# EAGLE design AST1031 (EAGLE 6.3)
DATABASE: ./../../../../../Components/TinyCircuits_Part_Database.txt
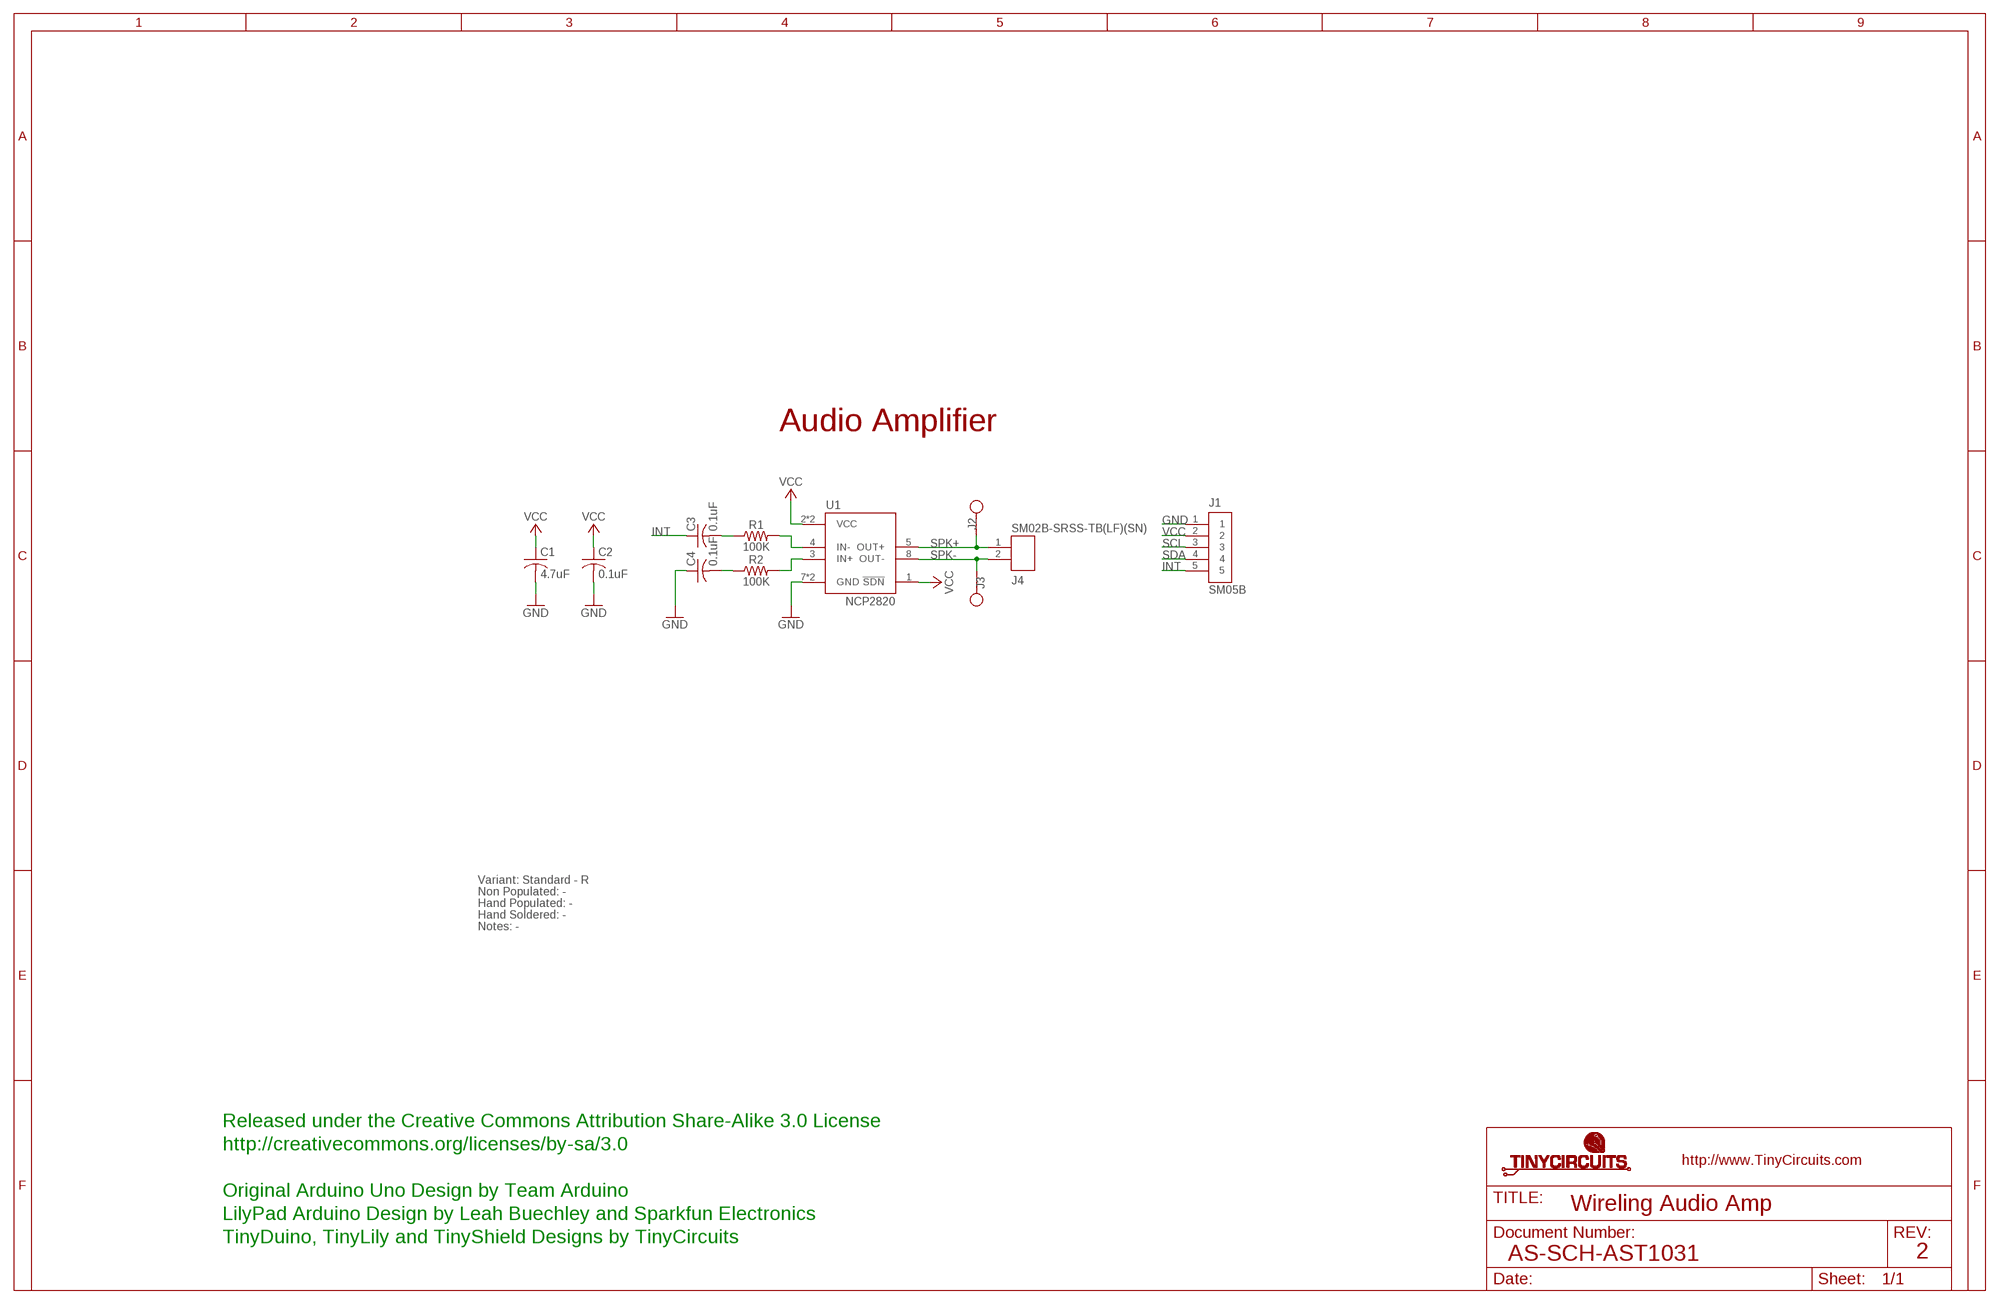
[diagram p0: schematic, sheet 1]

## Parts
C1  4.7uF  AS-ITM-00088  [C0603]
C2  0.1uF  AS-ITM-00008  [C0402]
C3  0.1uF  AS-ITM-00008  [C0402]
C4  0.1uF  AS-ITM-00008  [C0402]
J1  SM05B  AS-ITM-00340EDGE  [JST_SH_5X1_EDGE]
J2  0.78MM_TH  [0.78MM_TH]
J3  0.78MM_TH  [0.78MM_TH]
J4  SM02B-SRSS-TB(LF)(SN)  AS-ITM-00231  [JST_SH_2X1]
R1  100K  AS-ITM-00004  [0402]
R2  100K  AS-ITM-00004  [0402]
U1  NCP2820  AS-ITM-00370  [WSON-8]

## Nets
GND: C1.2 C2.2 C4.1 J1.1 U1.7(GND) U1.9(GND)
INT: C3.1 J1.5
N$1: R1.2 U1.4(IN-)
N$2: R2.2 U1.3(IN+)
N$3: C3.2 R1.1
N$4: C4.2 R2.1
SCL: J1.3
SDA: J1.4
SPK+: J2.P$1 J4.1 U1.5(OUT+)
SPK-: J3.P$1 J4.2 U1.8(OUT-)
VCC: C1.1 C2.1 J1.2 U1.1(!SDN) U1.2(VCC) U1.6(VCC)

## Notes on the sheet
- Audio Amplifier
- Variant: Standard - R
- Non Populated: -
- Hand Populated: -
- Hand Soldered: -
- Notes: -
- Released under the Creative Commons Attribution Share-Alike 3.0 License
- http://creativecommons.org/licenses/by-sa/3.0
- Original Arduino Uno Design by Team Arduino
- Wireling Audio Amp
- LilyPad Arduino Design by Leah Buechley and Sparkfun Electronics
- TinyDuino, TinyLily and TinyShield Designs by TinyCircuits
- AS-SCH-AST1031 | 2

## Library data of the parts
C1 = tinycircuits:AS-ITM-00088: CAP CER 4.7UF 6.3V 20% X5R 0603; PARTNO: AS-ITM-00088
C2-C4 = tinycircuits:AS-ITM-00008: CAP CER 0.1UF 16V 10% X5R 0402; PARTNO: AS-ITM-00008
J1 = tinycircuits:AS-ITM-00340: CONN HEADER SH 5POS SIDE 1MM TIN; PARTNO: AS-ITM-00340; PNPROTATION: 180
J2 J3 = tinycircuits:0.78MM_TH: 0.78mm Through-hole pad for use with pogo pins.
J4 = tinycircuits:AS-ITM-00231: CONN HEADER SH 2POS SIDE 1MM; PARTNO: AS-ITM-00231; PNPROTATION: 180
R1 R2 = tinycircuits:AS-ITM-00004: RES 100K OHM 1/16W 1% 0402; PARTNO: AS-ITM-00004
U1 = tinycircuits:AS-ITM-00370: IC PWR AMP AUD 2.65W D 8UDFN; PARTNO: AS-ITM-00370; PNPROTATION: 90

## Net classes
2 gnd: width 0.305 mm, drill 0.559 mm, clearance 0.254 mm

## Board
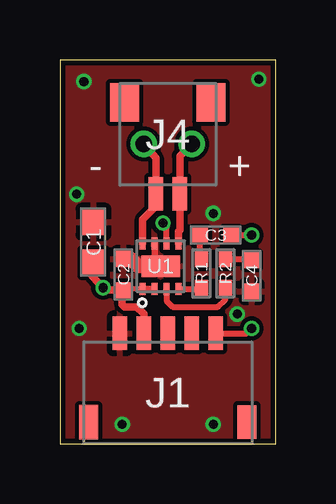
[diagram p1: board, top side]
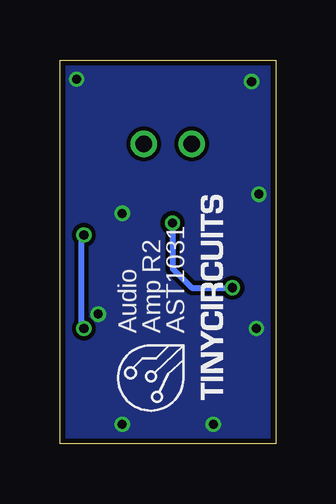
[diagram p2: board, bottom side, seen from below]

Size 9 x 16 mm. Coordinates in mm from the lower left corner, seen from the top.
Outline: 0,0 9,0 9,16 0,16 0,0
Copper layers (1*16): Top 0.035mm / dielectric 1.5mm / Bottom 0.035mm
Design rules "default *": minimum track width 8mil, minimum drill 15mil, track to track 7mil, track to pad 7mil, pad to pad 7mil, via to via 7mil, smd to smd 7mil, copper to edge 8mil, drill to drill 8mil, minimum pad ring 8mil, minimum via ring 5mil, stop-mask expansion 4mil, vias tented up to drill 25mil, thermal gap 10mil

### Footprints (pad centres in the part's own frame; a part is rotated, then mirrored left to right if it is on the bottom)
C0603 = smd 1.1 x 1: 1 -0.85,0; 2 0.85,0
C0402 = smd 0.65 x 0.6: 1 -0.65,0; 2 0.65,0
JST_SH_5X1_EDGE = smd 0.6 x 1.4: 1 -2,2.475; 2 -1,2.475; 3 0,2.475; 4 1,2.475; 5 2,2.475 | smd 0.8 x 1.4: PAD1 -3.3,-1.225; PAD2 3.3,-1.225
0.78MM_TH = drill 0.68 pad 0.9: P$1 0,0
JST_SH_2X1 = smd 0.6 x 1.4: 1 -0.5,2.475; 2 0.5,2.475 | smd 1.2 x 1.6: PAD1 -1.8,-1.325; PAD2 1.8,-1.325
0402 = smd 0.65 x 0.55: 1 -0.6,0; 2 0.6,0
WSON-8 = smd 0.25 x 0.5: 1 -0.75,-0.95; 2 -0.25,-0.95; 3 0.25,-0.95; 4 0.75,-0.95; 5 0.75,0.95; 6 0.25,0.95; 7 -0.25,0.95; 8 -0.75,0.95 | smd 1.6 x 0.9: 9 0,0

### Placement (x,y rotation side)
C1  1.4,8.4 90 top
C2  2.65,7.05 90 top
C3  6.5,8.7 180 top
C4  8,7 90 top
J1  4.5,2.12 0 top
J2  5.5,12.5 0 top
J3  3.5,12.5 0 bottom
J4  4.5,12.9 180 top
R1  5.9,7.1 270 top
R2  6.9,7.1 270 top
U1  4.2,7.4 0 top
U$1  [DOCFIELD-TINYCIRCUITS-PCB]  18.5,-10 0 top  (outside the outline)

### Tracks (layer width: path | path; a pad name or v marks a point on that pad's centre or on a via)
GND  (via drill 0.38)
  Top 0.254: U1.7 3.95,7.65 U1.9
  Top 0.61: C2.2 2.95,7.7 3.25,7.4 U1.9
  other vias: 2.6,0.8 6.4,0.8 0.8,4.8 0.7,10.4 1,15.1 8.3,15.2 6.4,9.6 7.4,5.4
  pour Bottom: 0,16 9,16 9,0 0,0
  pour Top: 0,16 9,16 9,0 0,0
INT  (via drill 0.38)
  Top 0.254: J1.5 7.8,4.6 v8,4.8 | C3.1 v8,8.7
  Bottom 0.254: v8,4.8 8.1,4.9 8.1,8.6 v8,8.7
N$1
  Top 0.254: U1.4 5.75,6.45 R1.2
N$2
  Top 0.254: U1.3 4.45,5.95 4.7,5.7 6.6,5.7 6.9,6 R2.2
N$3
  Top 0.254: R1.1 5.85,7.7 C3.2
N$4
  Top 0.254: R2.1 7.75,7.7 C4.2
SPK+
  Top 0.305: J2.P$1 5,12 J4.1 5,8.9 4.95,8.85 U1.5
SPK-
  Top 0.305: J3.P$1 4,11.9 J4.2 3.9,10.32 3.9,9.8 3.45,9.35 U1.8
VCC  (via drill 0.38)
  Top 0.203: U1.1 2.65,6.45 C2.1
  Top 0.254: U1.2 U1.1 | U1.6 4.45,9.05 v4.3,9.2 | 1.35,7 C1.1
  Top 0.305: J1.2 3.5,5.4 3.2,5.7 2.7,5.7 2.6,5.8 2.6,6.45 C2.1 1.9,6.4 v1.8,6.5 1.35,7
  Bottom 0.254: v4.3,9.2 4.3,7.3 3.5,6.5 v1.8,6.5

### Text on the board
tPlace: - | +
bPlace: AST1031 | Amp R2 | Audio
Document: FABRICATION DRAWING | NOTES: | 1. PRINTED CIRCUIT BOARD MADE FROM NEMA GRADE FR-4 EPOXY LAMINATE | WITH 1 OUNCE COPPER PLATING AND .024 THICKNESS. | 2. ALL DIMENSIONS ARE GIVEN IN MILLIMETERS. | 3. CIRCUIT PATHS ARE FOR REFERENCE ONLY. | 4. HOLE SIZES SHOWN ARE FINISHED DIAMETERS AFTER PLATING. | 5. BOARD PLATED USING REFLOW OR SIMILAR METHOD. | 6. BOARD TO HAVE BLUE SOLDER MASK ON PLATED SURFACES USING WET FILM | 7. SILKSCREEN BOARD USING WHITE INK. | SR100 OR SR1010 EPOXY. EQUIVALENT WET OR DRY FILM MAY BE USED. | 8. THE FOLLOWING INFORMATION APPLIES TO THIS BOARD: | * 2 COPPER LAYERS | * .024 BOARD THICKNESS | * REQUIRES TOP SIDE SILKSCREEN | Released under the Creative Commons Attribution Share-Alike 3.0 License | http://creativecommons.org/licenses/by-sa/3.0 | Original Arduino Uno Design by Team Arduino | LilyPad Arduino Design by Leah Buechley and Sparkfun Electronics | TinyDuino, TinyLily and TinyShield Designs by TinyCircuits | Wireling Audio Amp | AS-PCB-AST1031 | 2